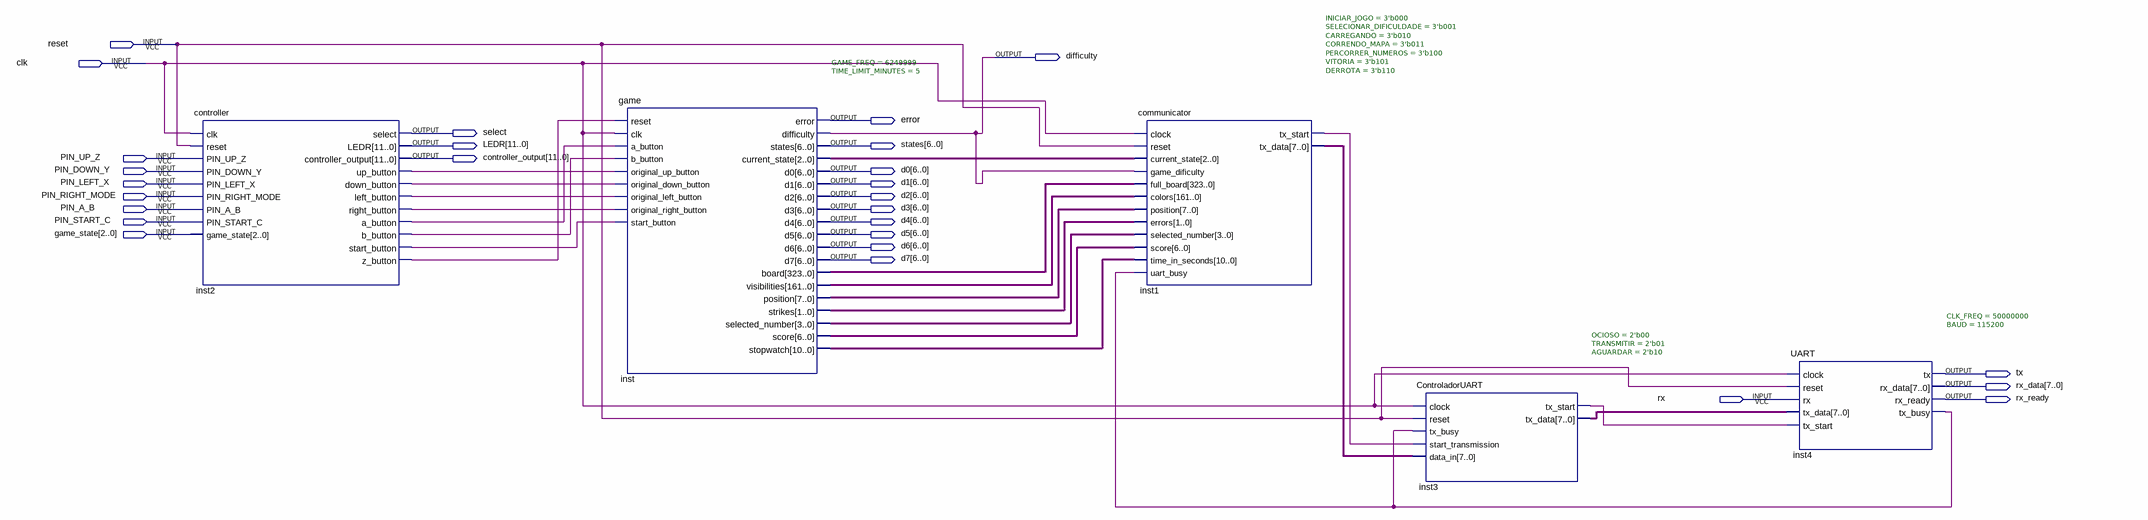
[diagram p0: schematic sheet]
// Quartus schematic top.bdf as structural Verilog: 5 symbols, 27 pins
module top (
  input  reset,
  input  clk,
  input  PIN_UP_Z,
  input  PIN_DOWN_Y,
  input  PIN_LEFT_X,
  input  PIN_RIGHT_MODE,
  input  PIN_A_B,
  input  PIN_START_C,
  input  [2:0] game_state,
  input  rx,
  output difficulty,
  output error,
  output select,
  output [11:0] LEDR,
  output [6:0] states,
  output [11:0] controller_output,
  output [6:0] d0,
  output [6:0] d1,
  output [6:0] d2,
  output [6:0] d3,
  output [6:0] d4,
  output [6:0] d5,
  output [6:0] d6,
  output [6:0] d7,
  output tx,
  output [7:0] rx_data,
  output rx_ready
);

  wire inst1_tx_start, inst2_a_button, inst2_b_button, inst2_down_button, inst2_left_button,
       inst2_right_button, inst2_start_button, inst2_up_button, inst2_z_button, inst3_tx_start, inst4_tx_busy;
  wire [1:0] inst_strikes;
  wire [2:0] inst_current_state;
  wire [3:0] inst_selected_number;
  wire [6:0] inst_score;
  wire [7:0] inst1_tx_data, inst3_tx_data, inst_position;
  wire [10:0] inst_stopwatch;
  wire [161:0] inst_visibilities;
  wire [323:0] inst_board;

  controller inst2 (
    .clk(clk), .reset(reset), .PIN_UP_Z(PIN_UP_Z), .PIN_DOWN_Y(PIN_DOWN_Y), .PIN_LEFT_X(PIN_LEFT_X),
    .PIN_RIGHT_MODE(PIN_RIGHT_MODE), .PIN_A_B(PIN_A_B), .PIN_START_C(PIN_START_C), .game_state(game_state),
    .select(select), .LEDR(LEDR), .controller_output(controller_output), .up_button(inst2_up_button),
    .down_button(inst2_down_button), .left_button(inst2_left_button), .right_button(inst2_right_button),
    .a_button(inst2_a_button), .b_button(inst2_b_button), .start_button(inst2_start_button),
    .z_button(inst2_z_button));
  game #(.GAME_FREQ(6249999), .TIME_LIMIT_MINUTES(5)) inst (
    .reset(inst2_z_button), .clk(clk), .a_button(inst2_a_button), .b_button(inst2_b_button),
    .original_up_button(inst2_up_button), .original_down_button(inst2_down_button),
    .original_left_button(inst2_left_button), .original_right_button(inst2_right_button),
    .start_button(inst2_start_button), .error(error), .difficulty(difficulty), .states(states),
    .current_state(inst_current_state), .d0(d0), .d1(d1), .d2(d2), .d3(d3), .d4(d4), .d5(d5), .d6(d6),
    .d7(d7), .board(inst_board), .visibilities(inst_visibilities), .position(inst_position),
    .strikes(inst_strikes), .selected_number(inst_selected_number), .score(inst_score),
    .stopwatch(inst_stopwatch));
  communicator #(.INICIAR_JOGO(3'b000), .SELECIONAR_DIFICULDADE(3'b001), .CARREGANDO(3'b010), .CORRENDO_MAPA(3'b011), .PERCORRER_NUMEROS(3'b100), .VITORIA(3'b101), .DERROTA(3'b110)) inst1 (
    .clock(clk), .reset(reset), .current_state(inst_current_state), .game_dificulty(difficulty),
    .full_board(inst_board), .colors(inst_visibilities), .position(inst_position), .errors(inst_strikes),
    .selected_number(inst_selected_number), .score(inst_score), .time_in_seconds(inst_stopwatch),
    .uart_busy(inst4_tx_busy), .tx_start(inst1_tx_start), .tx_data(inst1_tx_data));
  ControladorUART #(.OCIOSO(2'b00), .TRANSMITIR(2'b01), .AGUARDAR(2'b10)) inst3 (
    .clock(clk), .reset(reset), .tx_busy(inst4_tx_busy), .start_transmission(inst1_tx_start),
    .data_in(inst1_tx_data), .tx_start(inst3_tx_start), .tx_data(inst3_tx_data));
  UART #(.CLK_FREQ(50000000), .BAUD(115200)) inst4 (
    .clock(clk), .reset(reset), .rx(rx), .tx_data(inst3_tx_data), .tx_start(inst3_tx_start), .tx(tx),
    .rx_data(rx_data), .rx_ready(rx_ready), .tx_busy(inst4_tx_busy));
endmodule
